# EAGLE design Payload (EAGLE 9.6.2)
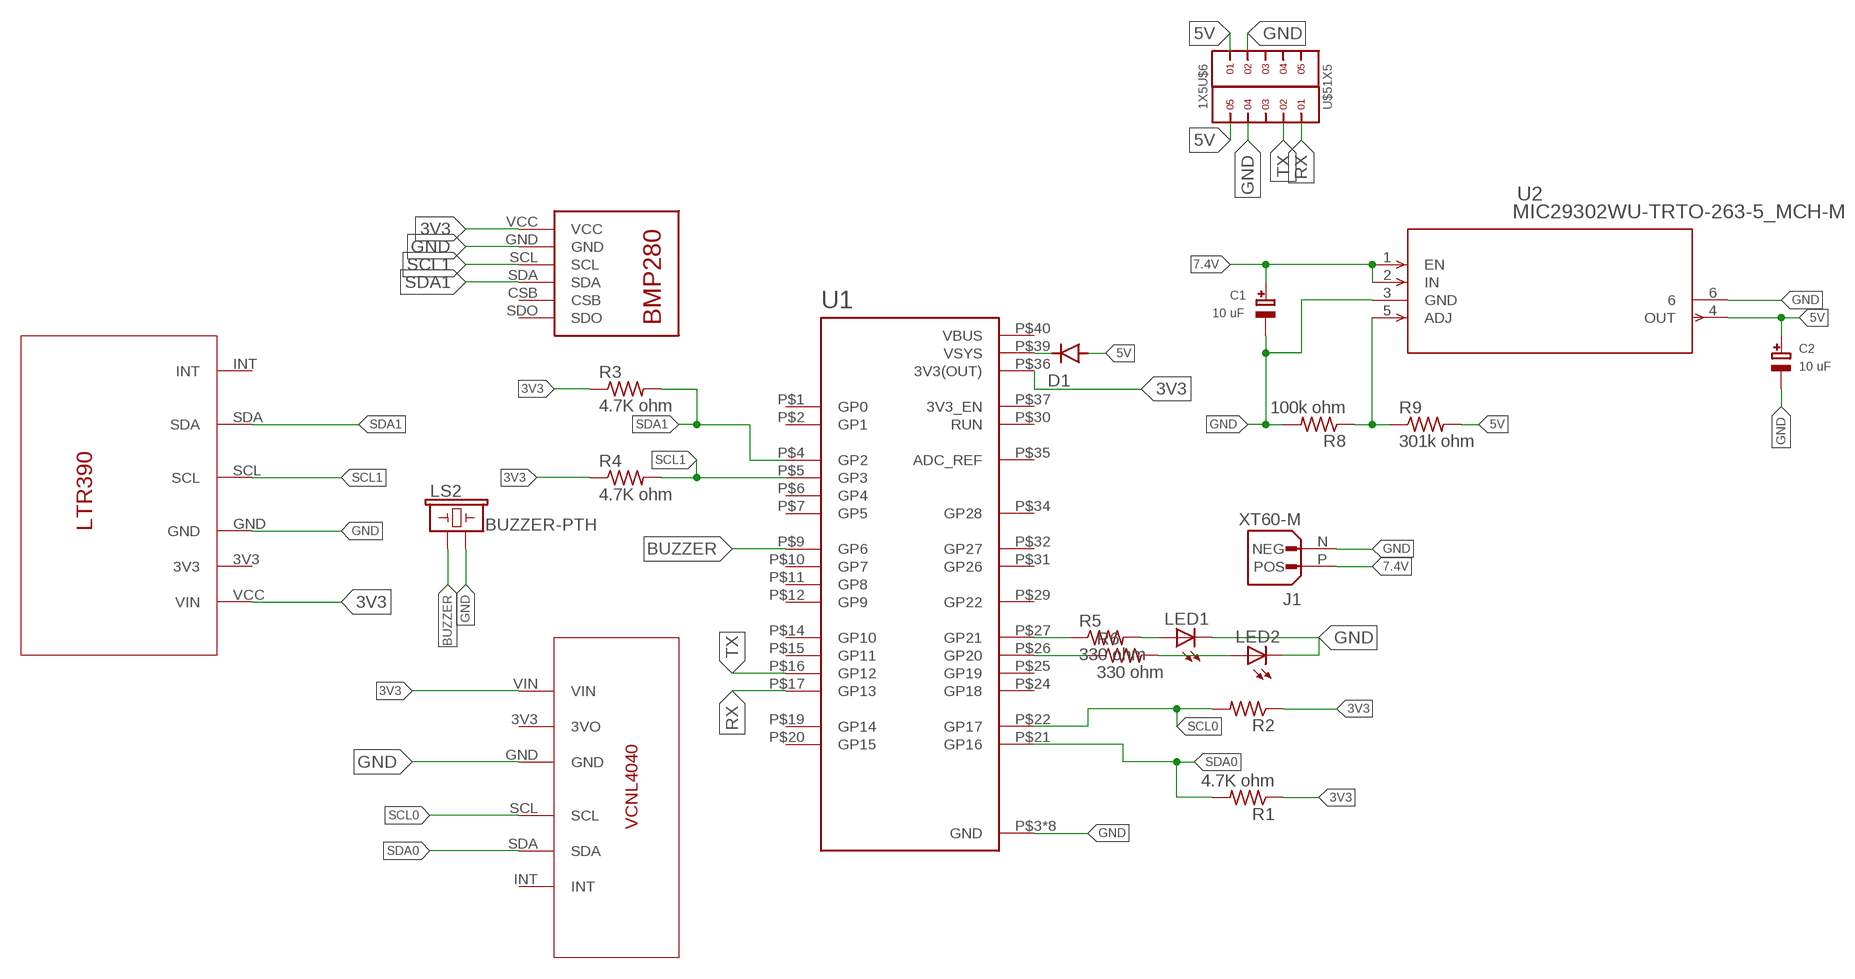
[diagram p0: schematic, sheet 1]

## Parts
C1  10 uF  CAP_TANTALUMA/3216_WAVE  [EIA3216-18/A-W]
C2  10 uF  CAP_TANTALUMA/3216_WAVE  [EIA3216-18/A-W]
D1  1N4004  [DO41-10]
J1  XT60-M  [AMASS_XT60-M]
LED1  LEDCHIPLED_1206  [CHIPLED_1206]
LED2  LEDCHIPLED_1206  [CHIPLED_1206]
LS2  BUZZER-PTH  [BUZZER-12MM]
R1  4.7K ohm  R-US_R0805  [R0805]
R2  4.7K ohm  R-US_R0805  [R0805]
R3  4.7K ohm  R-US_R0805  [R0805]
R4  4.7K ohm  R-US_R0805  [R0805]
R5  330 ohm  R-US_R0805  [R0805]
R6  330 ohm  R-US_R0805  [R0805]
R8  100k ohm  R-US_R0805  [R0805]
R9  301k ohm  R-US_R0805  [R0805]
U1  RASPBERRY_PICO-NO_DEBUG  [PICO-PKG-NO_DEBUG]
U2  MIC29302WU-TRTO-263-5_MCH-M  [TO-263-5_MCH-M]
U$1  VCNL4040  [VCNL4040]
U$3  BMP280  [BMP280]
U$4  LTR390  [LTR390]
U$5  1X5  [1X5]
U$6  1X5  [1X5]

## Nets
3V3: R1.1 R2.1 R3.1 R4.1 U1.P$36(3V3(OUT)) U$1.VIN U$3.VCC U$4.VCC(VIN)
5V: C2.+ D1.A R9.2 U2.4(OUT) U$5.5 U$6.1
7.4V: C1.+ J1.P(POS) U2.1(EN) U2.2(IN)
BUZZER: LS2.+ U1.P$9(GP6)
GND: C1.- C2.- J1.N(NEG) LED1.C LED2.C LS2.- R8.2 U1.P$3(GND) U1.P$8(GND) U1.P$13(GND) U1.P$18(GND) U1.P$23(GND) U1.P$28(GND) U1.P$33(GND) U1.P$38(GND) U2.3(GND) U2.6 U$1.GND U$3.GND U$4.GND U$5.4 U$6.2
N$1: D1.C U1.P$39(VSYS)
N$3: R5.1 U1.P$27(GP21)
N$4: LED2.A R6.2
N$5: LED1.A R5.2
N$6: R6.1 U1.P$26(GP20)
N$14: R8.1 R9.1 U2.5(ADJ)
RX: U1.P$17(GP13) U$5.1
SCL0: R2.2 U1.P$22(GP17) U$1.SCL
SCL1: R4.2 U1.P$5(GP3) U$3.SCL U$4.SCL
SDA0: R1.2 U1.P$21(GP16) U$1.SDA
SDA1: R3.2 U1.P$4(GP2) U$3.SDA U$4.SDA
TX: U1.P$16(GP12) U$5.2
Unconnected: U1.P$1(GP0) U1.P$2(GP1) U1.P$6(GP4) U1.P$7(GP5) U1.P$10(GP7) U1.P$11(GP8) U1.P$12(GP9) U1.P$14(GP10) U1.P$15(GP11) U1.P$19(GP14) U1.P$20(GP15) U1.P$24(GP18) U1.P$25(GP19) U1.P$29(GP22) U1.P$30(RUN) U1.P$31(GP26) U1.P$32(GP27) U1.P$34(GP28) U1.P$35(ADC_REF) U1.P$37(3V3_EN) U$1.3V3(3VO) U$1.INT U$3.CSB U$3.SDO U$4.3V3 U$4.INT U$5.3 U$6.3 U$6.4 U$6.5

## Power pins joined to a net without a drawn wire
VBUS: U1.P$40(VBUS)

## Library data of the parts
C1 C2 = microbuilder:CAP_TANTALUM: Tantalum Capacitors Wave footprints have larger pads and are meant to be used for hand soldering. Reflow footprints are optimised for solder paste and a reflow oven. EIA3216-18/A-[R/W] - Size A / 3216-18 / 1206 footprint 4.7µF 25V 10% Tantalum Capacitor 10µF 16V 10% Tantalum Capacitor [Digikey: 495-2236-2-ND] EIA3528-21/B-[R/W] - Size B / 3528-21 47µF 10V 10% Tantalum Capactior [Digikey: 495-2216-1-ND] EIA6032-28/C-[R/W] - Size C / 6032-28 10µF 35V 20% Tantalum Capacitor [Digikey: 495-2285-1-ND] 100µF 16V 10% Tantalum Capactior [Digikey: 399-5214-1-ND]
D1 = diode:1N4004: DIODE general purpose rectifier, 1 A
J1 = XT60-M:XT60-M: Check availability <https://pricing.snapeda.com/parts/XT60-M/AMASS/view-part?ref=eda>; AVAILABILITY: Not in stock; DESCRIPTION: Plug; DC supply; XT60; male; PIN: 2; for cable; soldered; 30A; 500V; MF: AMASS; MP: XT60-M; PACKAGE: Package; PRICE: None
LED1 LED2 = adafruit:LED: LED OSRAM: - CHIPLED LG R971, LG N971, LY N971, LG Q971, LY Q971, LO R971, LY R971 LH N974, LH R974 LS Q976, LO Q976, LY Q976 LO Q996 - Hyper CHIPLED LW Q18S LB Q993, LB Q99A, LB R99A - SideLED LS A670, LO A670, LY A670, LG A670, LP A670 LB A673, LV A673, LT A673, LW A673 LH A674 LY A675 LS A676, LA A676, LO A676, LY A676, LW A676 LS A679, LY A679, LG A679 - Hyper Micro SIDELED® LS Y876, LA Y876, LO Y876, LY Y876 LT Y87S - SmartLED LW L88C, LW L88S LB L89C, LB L89S, LG L890 LS L89K, LO L89K, LY L89K LS L896, LA L896, LO L896, LY L896 - TOPLED LS T670, LO T670, LY T670, LG T670, LP T670 LSG T670, LSP T670, LSY T670, LOP T670, LYG T670 LG T671, LOG T671, LSG T671 LB T673, LV T673, LT T673, LW T673 LH T674 LS T676, LA T676, LO T676, LY T676, LB T676, LH T676, LSB T676, LW T676 LB T67C, LV T67C, LT T67C, LS T67K, LO T67K, LY T67K, LW E67C LS E67B, LA E67B, LO E67B, LY E67B, LB E67C, LV E67C, LT E67C LW T67C LS T679, LY T679, LG T679 LS T770, LO T770, LY T770, LG T770, LP T770 LB T773, LV T773, LT T773, LW T773 LH T774 LS E675, LA E675, LY E675, LS T675 LS T776, LA T776, LO T776, LY T776, LB T776 LHGB T686 LT T68C, LB T68C - Hyper Mini TOPLED® LB M676 - Mini TOPLED Santana® LG M470 LS M47K, LO M47K, LY M47K Source: http://www.osram.convergy.de/
LS2 = SparkFun-Electromechanical:BUZZER: Buzzer Small round buzzers that operate around the audible 2kHz range. You can use these as speakers to create simple music or user interfaces. Variant Overview: PTH - Mini Speaker - PC Mount 12mm 2.048kHz <https://www.sparkfun.com/products/7950> PTH_KIT - Mini Speaker - PC Mount 12mm 2.048kHz <https://www.sparkfun.com/products/7950> KIT simplifies soldering by adding stop mask to one side of the pads. PTH_NO_SILK - Mini Speaker - PC Mount 12mm 2.048kHz <https://www.sparkfun.com/products/7950> No silkscreen indicator of buzzer outline. PTH_KIT_NO_SILK - Mini Speaker - PC Mount 12mm 2.048kHz <https://www.sparkfun.com/products/7950> KIT package w/o silkscreen SMD - Buzzer Audio Magnetic (CCV-084B16) SMD buzzer used on, e.g. the LilyPad Buzzer <https://www.sparkfun.com/products/8463> and RFID USB Reader <https://www.sparkfun.com/products/9963>. SMD_KIT - Buzzer Audio Magnetic (CCV-084B16) SMD Buzzer with elongated pins to make soldering easier. Used on the SparkFun Simon Says - Surface Mount Soldering Kit <https://www.sparkfun.com/products/10935>. SMD-SQUARE - Buzzer Audio Magnetic (COMP-15701) SMT square buzzer with one chamfered corner.; PROD_ID: COMP-08253; SF_SKU: COM-07950
R1-R6 R8 R9 = rcl:R-US_: RESISTOR, American symbol; SPICEPREFIX: R
U1 = RpiPico:RASPBERRY_PICO-NO_DEBUG
U2 = MIC29302WU:MIC29302WU-TR; COPYRIGHT: Copyright (C) 2024 Ultra Librarian. All rights reserved.; MANUFACTURER_PART_NUMBER: MIC29302WU-TR; MFR_NAME: Microchip
U$1 = VCNL4040:VCNL4040
U$3 = BMP280:BMP280
U$4 = LTR390:LTR390
U$5 U$6 = headers(.05in):1X5

## Board
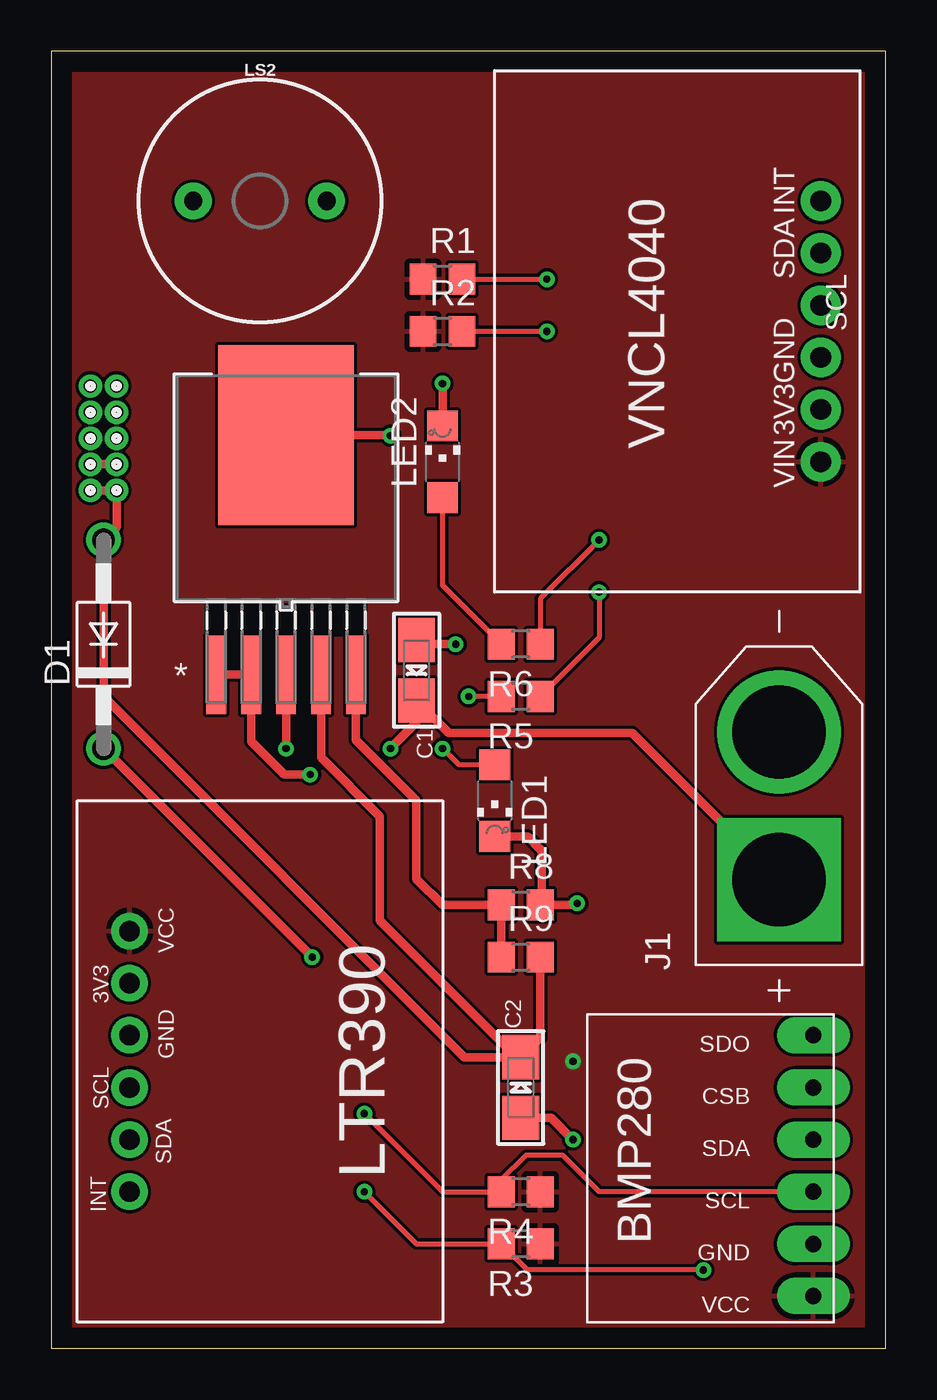
[diagram p1: board, top side]
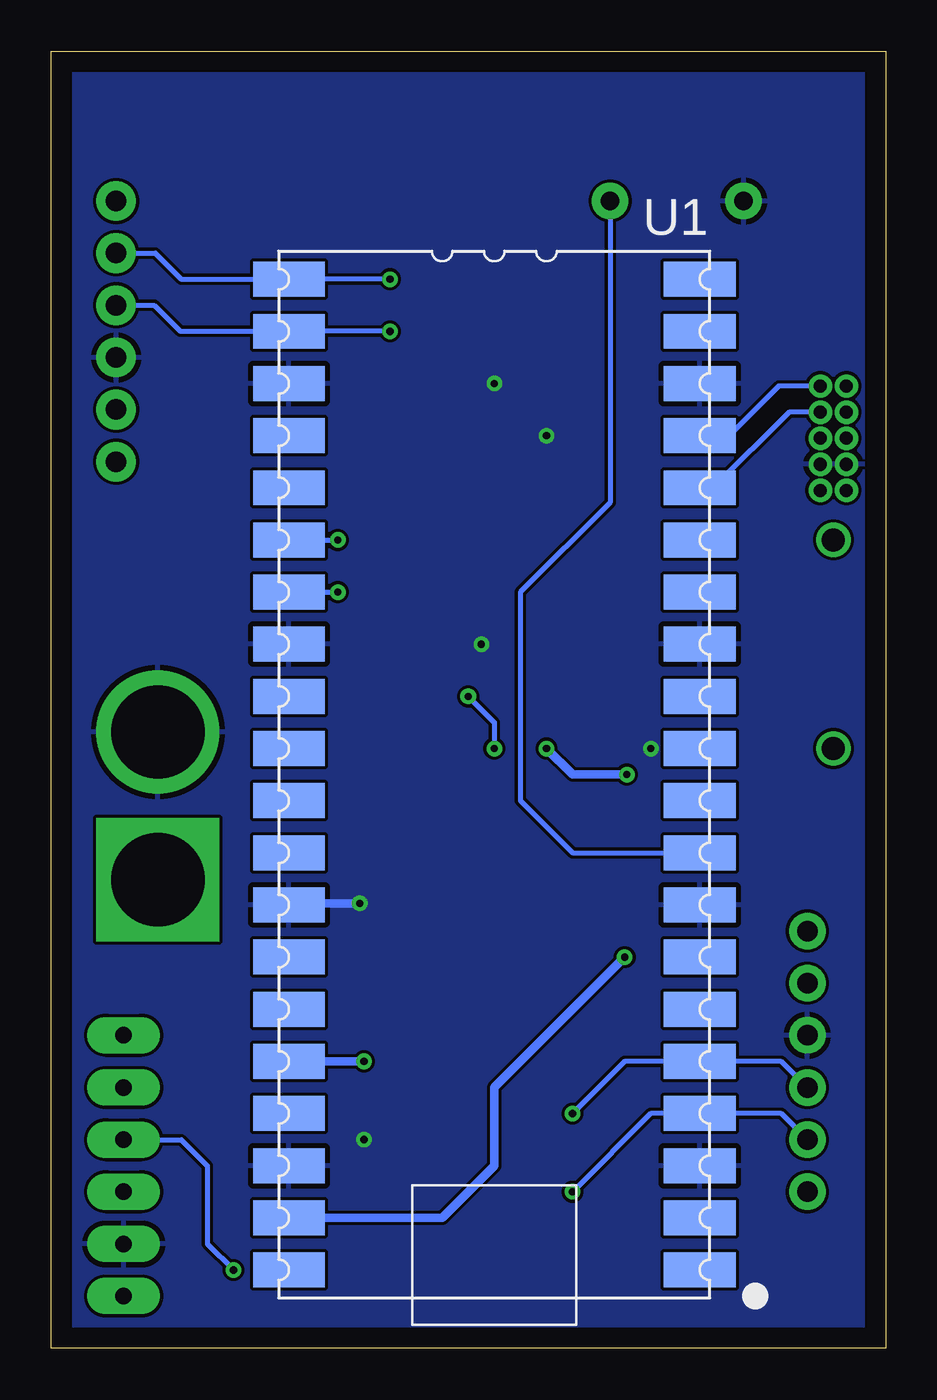
[diagram p2: board, bottom side, seen from below]

Size 40.62 x 63.17 mm. Coordinates in mm from the lower left corner, seen from the top.
Outline: 0,0 40.62,0 40.62,63.17 0,63.17 0,0
Copper layers (1*16): Top 0.035mm / dielectric 1.5mm / Bottom 0.035mm
Design rules "default": minimum track width 6mil, minimum drill 0.35mm, track to track 6mil, track to pad 6mil, pad to pad 6mil, via to via 6mil, smd to smd 6mil, copper to edge 40mil, drill to drill 6mil, minimum pad ring 10mil, minimum via ring 8mil, stop-mask expansion 4mil, vias tented up to drill 0mil, thermal gap 10mil

### Footprints (pad centres in the part's own frame; a part is rotated, then mirrored left to right if it is on the bottom)
EIA3216-18/A-W = smd 2.15 x 1.8: + 1.475,0; - -1.475,0
DO41-10 = drill 1.118: A 5.08,0; C -5.08,0
AMASS_XT60-M = drill 4.55 pad 6: N 3.6,0 | drill 4.55 pad 6 square: P -3.6,0
CHIPLED_1206 = smd 1.5 x 1.5: A 0,-1.75; C 0,1.75
BUZZER-12MM = drill 0.9 pad 1.778: + 3.25,0; - -3.25,0
R0805 = smd 1.3 x 1.5: 1 -0.95,0; 2 0.95,0
PICO-PKG-NO_DEBUG = smd 3.5 x 1.7: P$1 -8.73,25.4; P$2 -8.73,22.86; P$3 -8.73,20.32; P$4 -8.73,17.78; P$5 -8.73,15.24; P$6 -8.73,12.7; P$7 -8.73,10.16; P$8 -8.73,7.62; P$9 -8.73,5.08; P$10 -8.73,2.54; P$11 -8.73,0; P$12 -8.73,-2.54; P$13 -8.73,-5.08; P$14 -8.73,-7.62; P$15 -8.73,-10.16; P$16 -8.73,-12.7; P$17 -8.73,-15.24; P$18 -8.73,-17.78; P$19 -8.73,-20.32; P$20 -8.73,-22.86; P$21 11.27,-22.86; P$22 11.27,-20.32; P$23 11.27,-17.78; P$24 11.27,-15.24; P$25 11.27,-12.7; P$26 11.27,-10.16; P$27 11.27,-7.62; P$28 11.27,-5.08; P$29 11.27,-2.54; P$30 11.27,0; P$31 11.27,2.54; P$32 11.27,5.08; P$33 11.27,7.62; P$34 11.27,10.16; P$35 11.27,12.7; P$36 11.27,15.24; P$37 11.27,17.78; P$38 11.27,20.32; P$39 11.27,22.86; P$40 11.27,25.4
TO-263-5_MCH-M = smd 0.965 x 3.81: 1 -3.404,-9.106; 2 -1.702,-9.106; 3 0,-9.106; 4 1.702,-9.106; 5 3.404,-9.106 | smd 6.604 x 8.763: 6 0,2.565
VCNL4040 = drill 1 pad 1.93: 3V3 8.89,1.905; GND 11.43,1.905; INT 19.05,1.905; SCL 13.97,1.905; SDA 16.51,1.905; VIN 6.35,1.905
BMP280 = drill 0.8 pad 1.778 long: CSB 11.43,1; GND 3.81,1; SCL 6.35,1; SDA 8.89,1; SDO 13.97,1; VCC 1.27,1
LTR390 = drill 1 pad 1.778: 3V3 8.89,2.54; GND 11.43,2.54; INT 19.05,2.54; SCL 13.97,2.54; SDA 16.51,2.54; VCC 6.35,2.54
1X5 = drill 0.635 pad 1.016: 1 0,0; 2 1.27,0; 3 2.54,0; 4 3.81,0; 5 5.08,0

### Placement (x,y rotation side)
C1  17.78,33.02 270 top
C2  22.86,12.7 90 top
D1  2.54,34.29 90 top
J1  35.43,26.42 90 top
LED1  21.59,26.67 180 top
LED2  19.05,43.18 0 top
LS2  10.16,55.88 0 top
R1  19.05,52.07 0 top
R2  19.05,49.53 0 top
R3  22.86,5.08 180 top
R4  22.86,7.62 180 top
R5  22.86,31.75 180 top
R6  22.86,34.29 180 top
R8  22.86,21.59 0 top
R9  22.86,19.05 0 top
U1  17.78,29.21 180 bottom
U2  11.43,41.91 0 top
U$1  39.37,36.83 90 top
U$3  38.1,1.27 90 top
U$4  1.27,26.67 270 top
U$5  3.17,46.86 270 top
U$6  1.91,41.78 90 top

### Tracks (layer width: path | path; a pad name or v marks a point on that pad's centre or on a via)
3V3  (via drill 0.35)
  Bottom 0.406: U1.P$36 v25.4,13.97
  pour Top: -0.08,-0.03 40.61,-0.03 40.67,0.03 40.67,63.17 40.64,63.2 0,63.2 -0.08,63.12
5V
  Top 0.406: U$6.1 U$5.5 3.17,40.01 D1.A 2.54,31.75 20.11,14.18 C2.+ | R9.2 23.81,15.12 C2.+ | U2.4 13.13,28.78 16,25.91 16,20.83 22.66,14.18 C2.+
7.4V  (via drill 0.35)
  Top 0.406: U2.1 U2.2 9.73,29.54 11.33,27.94 v12.6,27.94 | v16.51,29.21 17.78,30.48 C1.+ 19.35,29.97 28.28,29.97 J1.P
  Bottom 0.406: v12.6,27.94 15.24,27.94 v16.51,29.21
BUZZER
  Bottom 0.254: LS2.+ 13.41,41.2 17.78,36.83 17.78,26.67 15.24,24.13 U1.P$9
GND  (via drill 0.35)
  Top 0.406: U2.3 v11.43,29.21 | C1.- 17.98,34.29 v19.68,34.29 | U$6.2 U$5.4 | C2.- 24.34,11.22 v25.4,10.16 | LED2.C v19.05,46.99 | 13.99,44.48 U2.6 16.48,44.48 v16.51,44.45 | LED1.C 23.19,24.92 23.88,24.23 23.88,21.66 R8.2 25.53,21.59 v25.6,21.67
  Bottom 0.406: v25.6,21.67 28.97,21.67 U1.P$33
  pour Bottom: -0.08,-0.04 40.65,-0.04 40.67,-0.03 40.67,63.17 40.61,63.22 0,63.22 -0.08,63.14
N$1  (via drill 0.35)
  Top 0.406: D1.C v12.7,19.05
  Bottom 0.406: v12.7,19.05 19.05,12.7 19.05,8.89 21.59,6.35 U1.P$39
N$3  (via drill 0.35)
  Top 0.254: v26.67,36.83 26.67,34.61 R5.1
  Bottom 0.254: U1.P$27 v26.67,36.83
N$4
  Top 0.254: R6.2 19.05,37.15 LED2.A
N$5  (via drill 0.35)
  Top 0.254: R5.2 v20.32,31.75 | LED1.A 19.84,28.42 v19.05,29.21
  Bottom 0.254: v20.32,31.75 19.05,30.48 v19.05,29.21
N$6  (via drill 0.35)
  Top 0.254: v26.67,39.37 23.81,36.51 R6.1
  Bottom 0.254: U1.P$26 v26.67,39.37
N$14
  Top 0.406: U2.5 14.83,29.62 17.78,26.67 17.78,22.86 19.05,21.59 R8.1 R9.1
RX
  Bottom 0.254: U$5.1 5.21,46.86 7.62,44.45 U1.P$17
SCL0  (via drill 0.35)
  Top 0.254: R2.2 v24.13,49.53
  Bottom 0.254: v24.13,49.53 U1.P$22 34.34,49.53 35.61,50.8 U$1.SCL
SCL1  (via drill 0.35)
  Top 0.254: v15.24,11.43 19.05,7.62 R4.2 21.91,8.19 23.11,9.4 24.89,9.4 26.67,7.62 U$3.SCL
  Bottom 0.254: U$4.SCL 5.08,13.97 U1.P$5 12.7,13.97 v15.24,11.43
SDA0  (via drill 0.35)
  Top 0.254: R1.2 v24.13,52.07
  Bottom 0.254: v24.13,52.07 U1.P$21 34.29,52.07 35.56,53.34 U$1.SDA
SDA1  (via drill 0.35)
  Top 0.254: v15.24,7.62 17.78,5.08 R3.2 23.18,3.81 v31.75,3.81
  Bottom 0.254: U$4.SDA 5.08,11.43 U1.P$4 11.43,11.43 v15.24,7.62 | U$3.SDA 34.29,10.16 33.02,8.89 33.02,5.08 v31.75,3.81
TX
  Bottom 0.254: U$5.2 4.7,45.59 8.38,41.91 U1.P$16